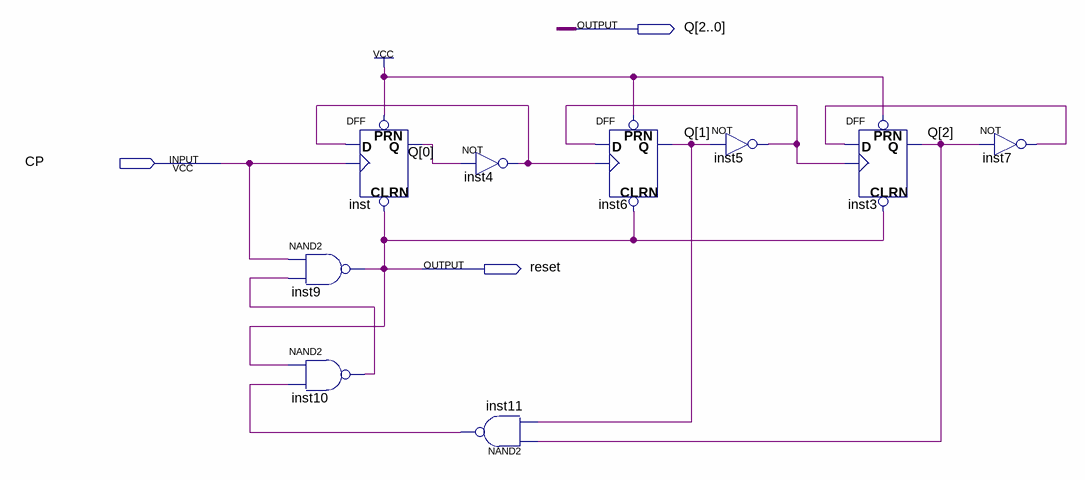
[diagram p0: schematic sheet]
// Quartus schematic lab4.bdf as structural Verilog: 9 symbols, 3 pins
module lab4 (
  input  CP,
  output [2:0] Q,
  output reset
);

  wire inst4_out, inst5_out, inst7_out, inst10_out, inst11_out;

  nand inst9 (reset, CP, inst10_out);
  nand inst10 (inst10_out, reset, inst11_out);
  DFF inst (.CLRN(reset), .CLK(CP), .D(inst4_out), .PRN(1'b1), .Q(Q[0]));
  not inst4 (inst4_out, Q[0]);
  nand inst11 (inst11_out, Q[2], Q[1]);
  DFF inst6 (.CLRN(reset), .CLK(inst4_out), .D(inst5_out), .PRN(1'b1), .Q(Q[1]));
  not inst5 (inst5_out, Q[1]);
  DFF inst3 (.CLRN(reset), .CLK(inst5_out), .D(inst7_out), .PRN(1'b1), .Q(Q[2]));
  not inst7 (inst7_out, Q[2]);
endmodule
